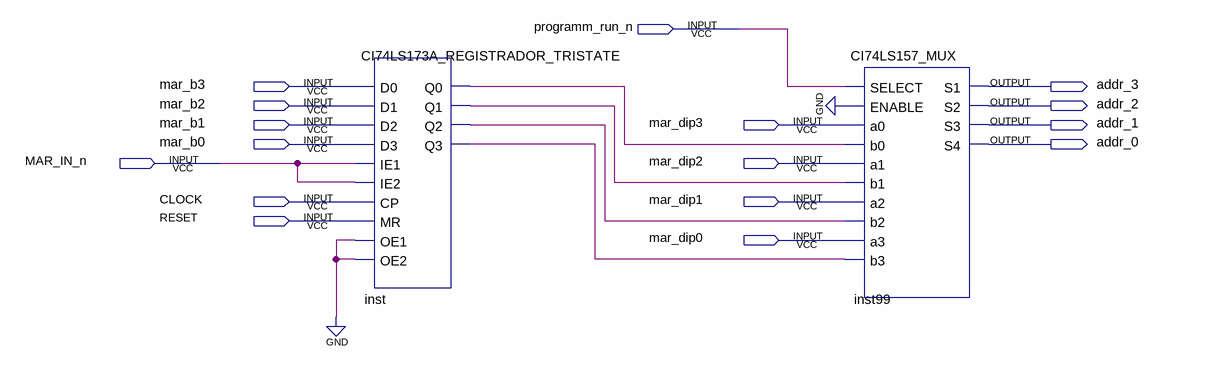
[diagram p0: schematic sheet]
// Quartus schematic Registrador_MAR.bdf as structural Verilog: 2 symbols, 16 pins
module Registrador_MAR (
  input  programm_run_n,
  input  mar_b3,
  input  mar_b2,
  input  mar_b1,
  input  mar_dip3,
  input  mar_b0,
  input  MAR_IN_n,
  input  mar_dip2,
  input  CLOCK,
  input  mar_dip1,
  input  RESET,
  input  mar_dip0,
  output addr_3,
  output addr_2,
  output addr_1,
  output addr_0
);

  wire inst_q0, inst_q1, inst_q2, inst_q3;

  CI74LS173A_REGISTRADOR_TRISTATE inst (
    .D0(mar_b3), .D1(mar_b2), .D2(mar_b1), .D3(mar_b0), .IE1(MAR_IN_n), .IE2(MAR_IN_n), .CP(CLOCK),
    .MR(RESET), .OE1(1'b0), .OE2(1'b0), .Q2(inst_q2), .Q1(inst_q1), .Q3(inst_q3), .Q0(inst_q0));
  CI74LS157_MUX inst99 (
    .SELECT(programm_run_n), .ENABLE(1'b0), .a0(mar_dip3), .b0(inst_q0), .a1(mar_dip2), .b1(inst_q1),
    .a2(mar_dip1), .b2(inst_q2), .a3(mar_dip0), .b3(inst_q3), .S1(addr_3), .S2(addr_2), .S3(addr_1),
    .S4(addr_0));
endmodule
